# Altium schematic sheet OUTPUT.SchDoc
size A
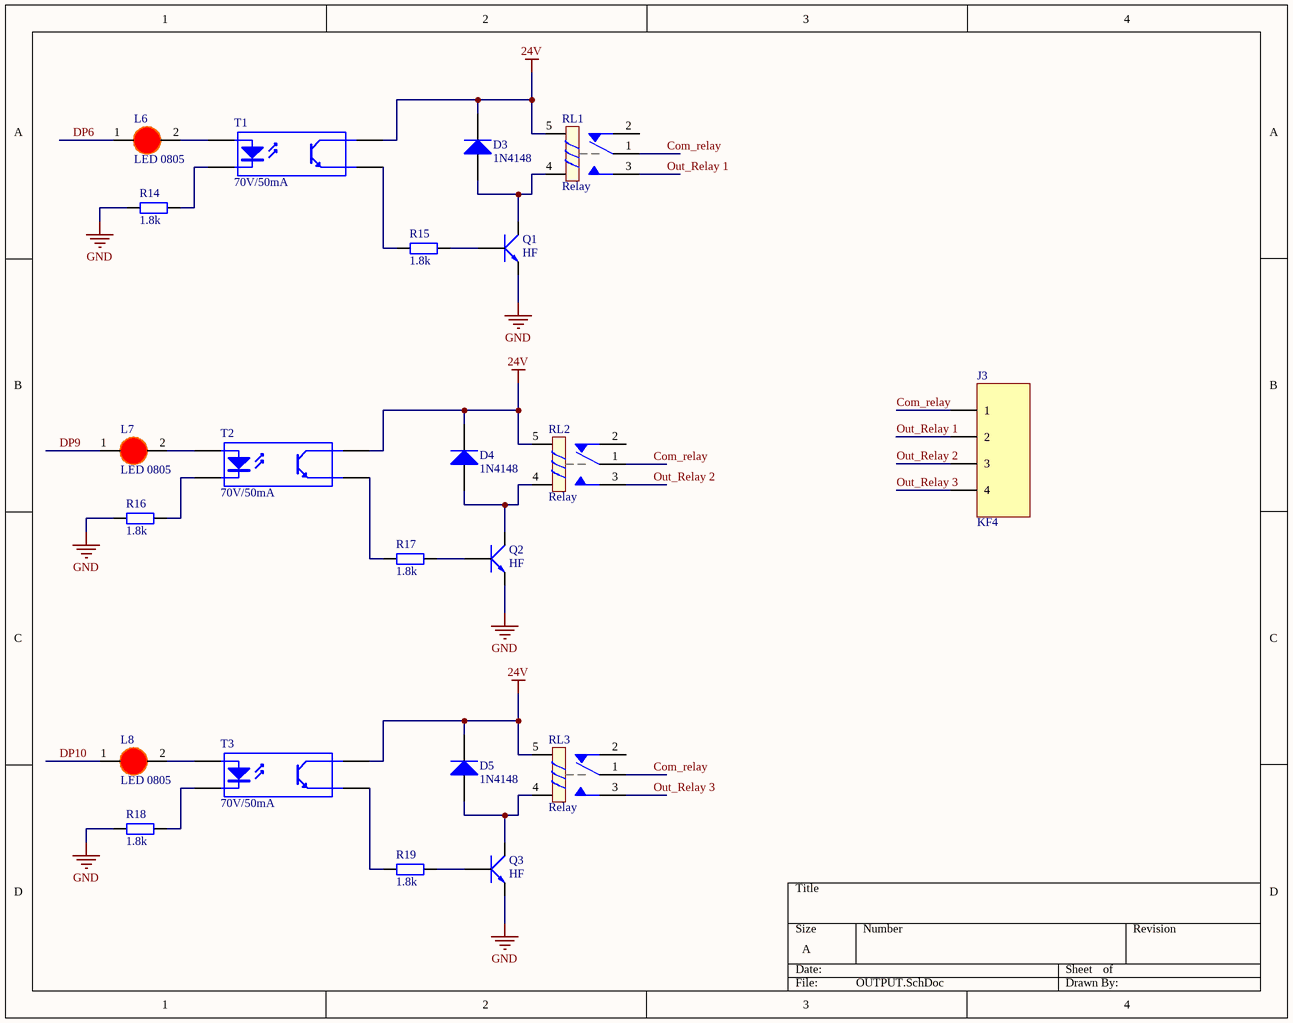
[diagram p0: OUTPUT.SchDoc]

## Parts
D3  1N4148  [SOD-123]
D4  1N4148  [SOD-123]
D5  1N4148  [SOD-123]
J3  KF4  [KF4-5.08]
L6  LED 0805  [LED-1206-Red]
L7  LED 0805  [LED-1206-Red]
L8  LED 0805  [LED-1206-Red]
Q1  HF  [SOT23]
Q2  HF  [SOT23]
Q3  HF  [SOT23]
R14  1.8k  [tro smd 0805]
R15  1.8k  [tro smd 0805]
R16  1.8k  [tro smd 0805]
R17  1.8k  [tro smd 0805]
R18  1.8k  [tro smd 0805]
R19  1.8k  [tro smd 0805]
RL1  Relay  [Relay 5 Chan SRD]
RL2  Relay  [Relay 5 Chan SRD]
RL3  Relay  [Relay 5 Chan SRD]
T1  70V/50mA  [OPTO TRANSISTOR_SMD-4]
T2  70V/50mA  [OPTO TRANSISTOR_SMD-4]
T3  70V/50mA  [OPTO TRANSISTOR_SMD-4]

## Nets
24V: D3.2(K) D4.2(K) D5.2(K) RL1.5 RL2.5 RL3.5 T1.4 T2.4 T3.4
GND: Q1.2(E) Q2.2(E) Q3.2(E) R14.1 R16.1 R18.1
Com_relay: J3.1 RL1.1 RL2.1 RL3.1
DP6: L6.1(A)
DP9: L7.1(A)
DP10: L8.1(A)
Out_Relay 1: J3.2 RL1.3
Out_Relay 2: J3.3 RL2.3
Out_Relay 3: J3.4 RL3.3
NetD3_1: D3.1(A) Q1.3(C) RL1.4
NetD4_1: D4.1(A) Q2.3(C) RL2.4
NetD5_1: D5.1(A) Q3.3(C) RL3.4
NetL6_2: L6.2(K) T1.1
NetL7_2: L7.2(K) T2.1
NetL8_2: L8.2(K) T3.1
NetQ1_1: Q1.1(B) R15.2
NetQ2_1: Q2.1(B) R17.2
NetQ3_1: Q3.1(B) R19.2
NetR14_2: R14.2 T1.2
NetR15_1: R15.1 T1.3
NetR16_2: R16.2 T2.2
NetR17_1: R17.1 T2.3
NetR18_2: R18.2 T3.2
NetR19_1: R19.1 T3.3

Not connected (* = marked no-connect by the designer): RL1 2; RL2 2; RL3 2

## Library data of the parts
D3-D5 = 1N4148-W-7: DIODE GEN PURP 100V 300MA SOD123; MPN: 1N4148W-7-F; MFR: Diodes Incorporated; Solder: SMT; Value: 100V/300MA
J3 = KF4: Manufacturer: W¨¹rth Elektronik eiSos GmbH; PartNo: 691133710004; ComponentLink1 Description: Manufacturer; ComponentLink2 Description: Datasheet; NoPins: 4; ComponentLink1 URL: http://www.we-online.com; ComponentLink2 URL: http://katalog.we-online.de/em/datasheet/6911337100xx.pdf; Created By: Baojun Chen; Created Date: 4-Aug-15
L6-L8 = LED 1206 Do: Dán; Don_Vi: Con; Ma_Hang: MH002334; Ten_Linh_Kien: LED1206 Màu Đỏ (Red); Ghi_Chu: *; Kieu_Chan: *; Chung_Loai: Dán
Q1-Q3 = C1815 HF SMD: NPN transistor; Value: C9014
R14-R19 = Tro 0805 5% 1.8k: Dán; Don_Vi: Con; So_Chan: 2; Ten_Linh_Kien: Trở 0805 5% 1.8k; Ma_Hang: MH005233; Chung_Loai: Dán; Kieu_Chan: *
RL1-RL3 = Relay 5 Chan SRD: Relay 5 Chan; Ma_Hang: MH009374; Ten: Relay 5V10A SRD-05VDC-SL-C Chính Hãng
T1-T3 = HCPL-817-500E: OPTOISOLATOR 5KV TRANSISTOR 4SMD; Solder: SMT; CompanyID: VT-00147; Value: 70V/50mA; MPN: HCPL-817-500E